# Altium project TS-RTD 1k Wheatstone PGA-ADC.PrjPcb
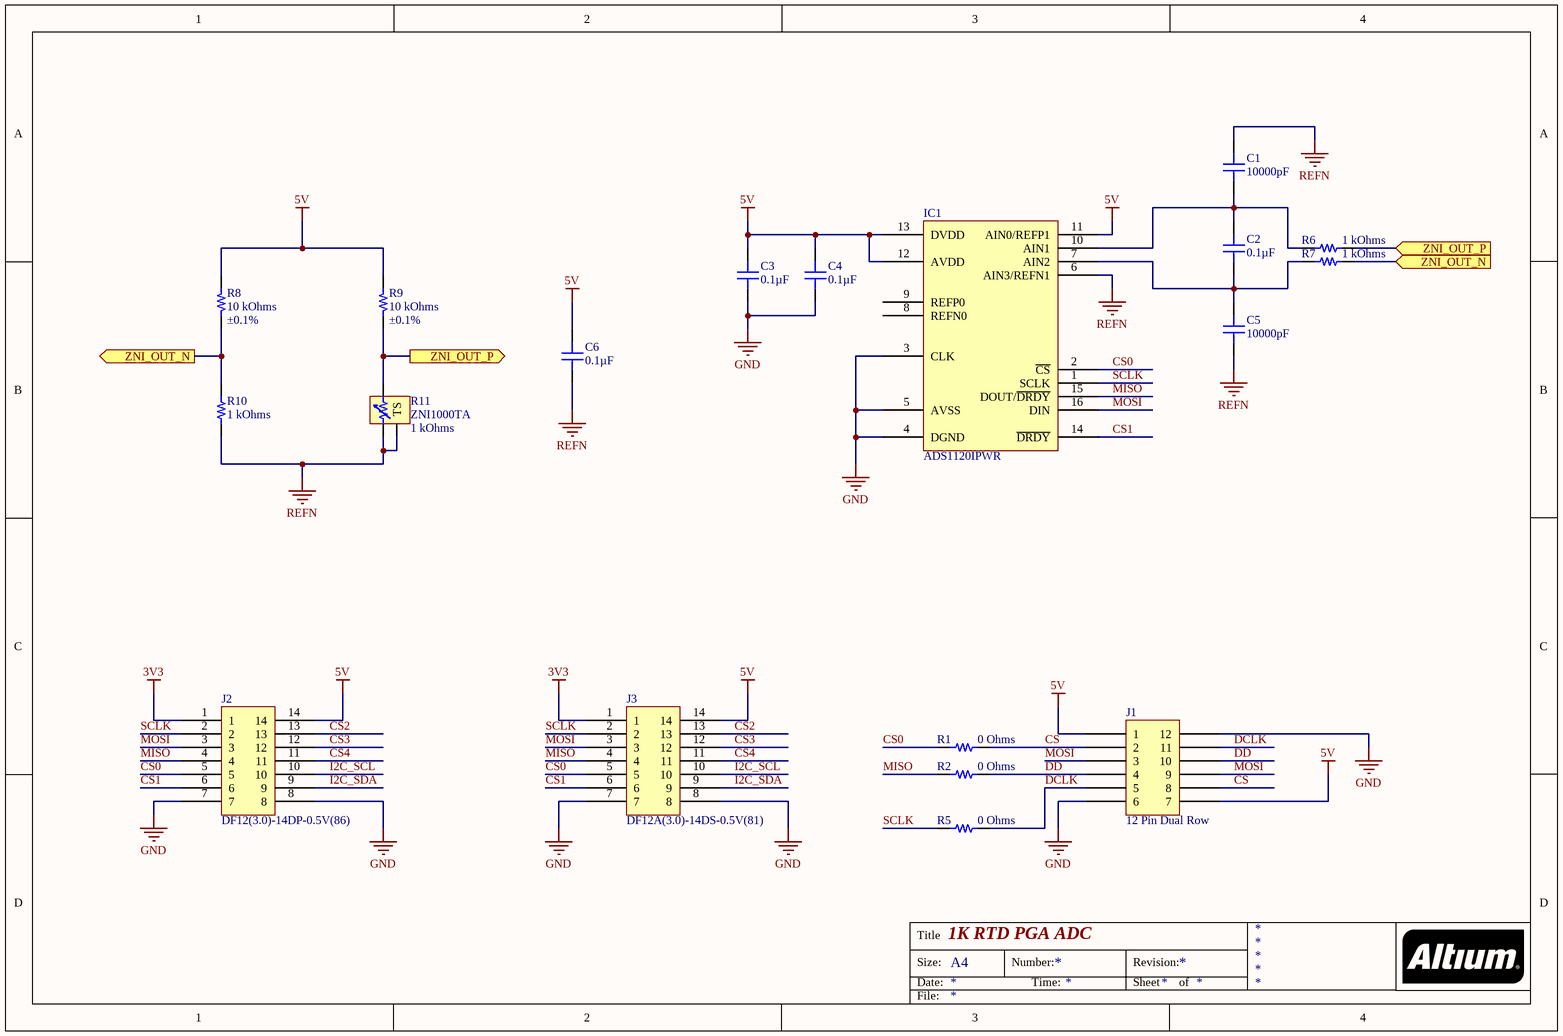
[diagram p0: RTD 1k Wheatstone PGA-ADC.SchDoc]
1 sheet, 19 parts. Net scope: flat (ports and power ports of the same name join across sheets).
Board file: RTD 1k Wheatstone PGA-ADC Card.PcbDoc

## Sheet RTD 1k Wheatstone PGA-ADC.SchDoc: 1K RTD PGA ADC
size A4

### Parts
C1  10000pF  [CAP 0603_1608]
C2  0.1µF  [CAP 0603_1608]
C3  0.1µF  [CAP 0603_1608]
C4  0.1µF  [CAP 0603_1608]
C5  10000pF  [CAP 0603_1608]
C6  0.1µF  [CAP 0603_1608]
IC1  ADS1120IPWR  [TI TSSOP-16 PW]
J1  12 Pin Dual Row  [TE 5650118-3 Card Edge]
J2  DF12(3.0)-14DP-0.5V(86)  [HIROSE DF12 3.0-14DP-0.5V 86]
J3  DF12A(3.0)-14DS-0.5V(81)  [HIROSE DF12A 3.0-14DS-0.5V 81]
R1  0 Ohms  [RES 0603_1608]
R2  0 Ohms  [RES 0603_1608]
R5  0 Ohms  [RES 0603_1608]
R6  1 kOhms  [RES 0603_1608]
R7  1 kOhms  [RES 0603_1608]
R8  Tolerance: ±0.1%  [RES 0603_1608]  (hidden comment: 10 kOhms)
R9  Tolerance: ±0.1%  [RES 0603_1608]  (hidden comment: 10 kOhms)
R10  1 kOhms  [RES 0603_1608]
R11  ZNI1000TA  Resistance @ 0°C: 1 kOhms  [DIODES SOT-23-3]

### Ports
ZNI_OUT_N (in), ZNI_OUT_N (out), ZNI_OUT_P (in), ZNI_OUT_P (out)

### Nets
3V3: J2.1 J3.1
5V: C3.1 C4.1 C6.1 IC1.11(AIN0/REFP1) IC1.12(AVDD) IC1.13(DVDD) J1.1 J1.7 J2.14 J3.14 R8.2 R9.2
GND: C3.2 C4.2 IC1.3(CLK) IC1.4(DGND) IC1.5(AVSS) J1.6 J1.12 J2.7 J2.8 J3.7 J3.8
REFN: C1.2 C5.1 C6.2 IC1.6(AIN3/REFN1) R10.1 R11.1 R11.3(TS)
CS: J1.2 J1.8 R1.2
CS0: IC1.2(~{CS}) J2.5 J3.5 R1.1
CS1: IC1.14(~{DRDY}) J2.6 J3.6
CS2: J2.13 J3.13
CS3: J2.12 J3.12
CS4: J2.11 J3.11
DCLK: J1.5 J1.11 R5.2
DD: J1.4 J1.10 R2.2
I2C_SCL: J2.10 J3.10
I2C_SDA: J2.9 J3.9
MISO: IC1.15(DOUT/~{DRDY}) J2.4 J3.4 R2.1
MOSI: IC1.16(DIN) J1.3 J1.9 J2.3 J3.3
SCLK: IC1.1(SCLK) J2.2 J3.2 R5.1
NetC1_1: C1.1 C2.1 IC1.10(AIN1) R6.2
NetC2_2: C2.2 C5.2 IC1.7(AIN2) R7.2
NetR6_1: R6.1 R9.1 R11.2 ; port ZNI_OUT_P
NetR7_1: R7.1 R8.1 R10.2 ; port ZNI_OUT_N

Not connected (* = marked no-connect by the designer): IC1 8(REFN0) 9(REFP0)

### Notes on the sheet
- Title
- Size:
- Date:
- A4
- Number:
- Time:
- Revision:
- Sheet
- of
- File:

### Library data of the parts
C1 C5 = AC0603KPX7R9BB103: CAP CER 10000PF 50V X7R 0603; Manufacturer: Yageo; Tolerance: ±10%; Part Number: AC0603KPX7R9BB103; Value: 10000pF; Applications: Automotive; Capacitance: 10000pF; ComponentLink1Description: Datasheet; ComponentLink1URL: http://www.yageo.com/NewPortal/_en/search/productDocs.jsp?YageoPartNumber=AC0603KPX7R9BB103; ComponentLink2Description: DigiKey Link; ComponentLink2URL: http://digikey.com/product-detail/en/yageo/AC0603KPX7R9BB103/311-3284-1-ND/6643536; Device Package: 0603 (1608 Metric); LastUpdated: 02/09/2020 01:03:31; Lifecycle Status: Active; Minimum Order: 1; Mounting Type: Surface Mount, MLCC; Operating Temperature: -55°C ~ 125°C; Package / Case: 0603 (1608 Metric); Packaging: TapeAndReel; PartId: 5188; Part Status: Active; Price: 0.01; Ratings: AEC-Q200; Series: AC; Size / Dimension: 0.063" L x 0.031" W (1.60mm x 0.80mm); Supplier 1: DigiKey; Supplier Part Number 1: 311-3284-1-ND; Temperature Coefficient: X7R; Thickness (Max): 0.035" (0.90mm); Voltage - Rated: 50V
C2-C4 C6 = CC0603ZRY5V7BB104: CAP CER 0.1UF 16V Y5V 0603; Manufacturer: Yageo; Temperature Coefficient: Y5V (F); Tolerance: -20%, +80%; Part Number: CC0603ZRY5V7BB104; Value: 0.1µF; Applications: General Purpose; Capacitance: 0.1µF; ComponentLink1Description: Datasheet; ComponentLink1URL: http://www.yageo.com/documents/recent/UPY-GPHC_Y5V_6.3V-to-50V_8.pdf; ComponentLink2Description: DigiKey Link; ComponentLink2URL: http://digikey.com/product-detail/en/yageo/CC0603ZRY5V7BB104/311-1369-1-ND/2103153; Device Package: 0603 (1608 Metric); LastUpdated: 21/01/2020 00:01:38; Lifecycle Status: Active; Minimum Order: 1; Mounting Type: Surface Mount, MLCC; Operating Temperature: -30°C ~ 85°C; Package / Case: 0603 (1608 Metric); Packaging: TapeAndReel; PartId: 17881; Part Status: Active; Price: 0.01; Series: CC; Size / Dimension: 0.063" L x 0.031" W (1.60mm x 0.80mm); Supplier 1: DigiKey; Supplier Part Number 1: 311-1369-1-ND; Thickness (Max): 0.035" (0.90mm); Voltage - Rated: 16V
IC1 = ADS1120IPWR: IC ADC 16BIT SIGMA-DELTA 16TSSOP; Manufacturer: Texas Instruments; Configuration: MUX-PGA-ADC; Data Interface: SPI; Input Type: Differential, Single Ended; Number of A/D Converters: 1; Number of Bits: 16; Number of Inputs: 2, 4; Reference Type: External, Internal, Supply; Sampling Rate (Per Second): 2k; Voltage - Supply, Analog: 2.3V ~ 5.5V; Part Number: ADS1120IPWR; Architecture: Sigma-Delta; ComponentLink1Description: Datasheet; ComponentLink1URL: http://www.ti.com/general/docs/suppproductinfo.tsp?distId=10&gotoUrl=http%3A%2F%2Fwww.ti.com%2Flit%2Fgpn%2Fads1120; ComponentLink2Description: DigiKey Link; ComponentLink2URL: //digikey.com/product-detail/en/texas-instruments/ADS1120IPWR/296-37280-2-ND/4701590; Device Package: 16-TSSOP (0.173", 4.40mm Width); Features: PGA, Temperature Sensor; LastUpdated: 02/12/2019 15:46:46; Lifecycle Status: 0; Minimum Order: 1; Mounting Type: Surface Mount; Operating Temperature: -40°C ~ 125°C; Package / Case: 16-TSSOP (0.173", 4.40mm Width); Packaging: TapeAndReel; PartId: 4; Part Status: Active; Price: 3.47; Series: -; Supplier 1: DigiKey; Supplier Part Number 1: 296-37280-2-ND; Supplier Device Package: 16-TSSOP; Voltage - Supply, Digital: 2.3V ~ 5.5V
J2 = DF12(3.0)-14DP-0.5V(86): CONN HDR 14POS SMD GOLD; Manufacturer: Hirose Electric Co Ltd; Connector Type: Header, Outer Shroud Contacts; Mated Stacking Heights: 3mm; Number of Positions: 14; Pitch: 0.020" (0.50mm); Part Number: DF12(3.0)-14DP-0.5V(86); ComponentLink1Description: Datasheet; ComponentLink1URL: https://www.hirose.com/product/download/?distributor=digikey&type=specSheet&lang=en&num=DF12(3.0)-14DP-0.5V(86); ComponentLink2Description: DigiKey Link; ComponentLink2URL: http://digikey.com/product-detail/en/hirose-electric-co-ltd/DF12-3.0-14DP-0.5V-86/H11701CT-ND/2172493; Contact Finish: Gold; Contact Finish Thickness: 8.00µin (0.203µm); Features: Board Guide, Solder Retention; Height Above Board: 0.091" (2.30mm); LastUpdated: 06/08/2020 22:47:47; Lifecycle Status: Active; Minimum Order: 1; Mounting Type: Surface Mount; Number of Rows: 2; Packaging: TapeAndReel; Part Status: Active; Price: 0.38; Series: DF12; Supplier 1: DigiKey; Supplier Part Number 1: H11701CT-ND
J3 = DF12A(3.0)-14DS-0.5V(81): CONN RCPT 14POS SMD GOLD; Manufacturer: Hirose Electric Co Ltd; Connector Type: Receptacle, Center Strip Contacts; Mated Stacking Heights: 3mm; Number of Positions: 14; Pitch: 0.020" (0.50mm); Part Number: DF12A(3.0)-14DS-0.5V(81); ComponentLink1Description: Datasheet; ComponentLink1URL: https://www.hirose.com/product/document?clcode=CL0537-0721-0-86&productname=DF12(3.0)-10DP-0.5V(86)&series=DF12&documenttype=Catalog&lang=en&documentid=D31693_en; ComponentLink2Description: DigiKey Link; ComponentLink2URL: http://digikey.com/product-detail/en/hirose-electric-co-ltd/DF12A-3.0-14DS-0.5V-81/H11713CT-ND/2172505; Contact Finish: Gold; Contact Finish Thickness: 8.00µin (0.203µm); Features: Board Guide; Height Above Board: 0.087" (2.20mm); LastUpdated: 06/08/2020 22:48:47; Lifecycle Status: Active; Minimum Order: 1; Mounting Type: Surface Mount; Number of Rows: 2; Packaging: TapeAndReel; Part Status: Active; Price: 0.36; Series: DF12; Supplier 1: DigiKey; Supplier Part Number 1: H11713CT-ND
R1 R2 R5 = ERJ-3GEY0R00V: RES SMD 0 OHM JUMPER 1/10W 0603; Manufacturer: Panasonic Electronic Components; Power (Watts): 0.1W, 1/10W; Part Number: ERJ-3GEY0R00V; Value: 0 Ohms; ComponentLink1Description: Datasheet; ComponentLink1URL: http://industrial.panasonic.com/www-cgi/jvcr13pz.cgi?E+PZ+3+AOA0001+ERJ3GEY0R00V+7+WW; ComponentLink2Description: DigiKey Link; ComponentLink2URL: http://digikey.com/product-detail/en/panasonic-electronic-components/ERJ-3GEY0R00V/P0.0GCT-ND/134711; Composition: Thick Film; Device Package: 0603 (1608 Metric); Features: Automotive AEC-Q200; Height - Seated (Max): 0.022" (0.55mm); LastUpdated: 13/08/2020 10:36:40; Lifecycle Status: Active; Minimum Order: 1; Number of Terminations: 2; Operating Temperature: -55°C ~ 155°C; Package / Case: 0603 (1608 Metric); Packaging: CutTape; PartId: 22603; Part Status: Active; Price: 0.10; Ratings: AEC-Q200; Resistance: 0 Ohms; Series: ERJ; Size / Dimension: 0.063" L x 0.031" W (1.60mm x 0.80mm); Supplier 1: DigiKey; Supplier Part Number 1: P0.0GCT-ND; Supplier Device Package: 0603; Tolerance: Jumper
R6 R7 R10 = ERJ-PB3B1001V: RES SMD 1K OHM 0.1% 1/5W 0603; Manufacturer: Panasonic Electronic Components; Power (Watts): 0.2W, 1/5W; Temperature Coefficient: ±50ppm/°C; Part Number: ERJ-PB3B1001V; Value: 1 kOhms; ComponentLink1Description: Datasheet; ComponentLink1URL: https://industrial.panasonic.com/cdbs/www-data/pdf/RDM0000/AOA0000C328.pdf; ComponentLink2Description: DigiKey Link; ComponentLink2URL: http://digikey.com/product-detail/en/panasonic-electronic-components/ERJ-PB3B1001V/P19972CT-ND/6214227; Composition: Thick Film; Device Package: 0603 (1608 Metric); Features: Automotive AEC-Q200, Pulse Withstanding; Height - Seated (Max): 0.022" (0.55mm); LastUpdated: 21/01/2020 00:19:14; Lifecycle Status: Active; Minimum Order: 1; Number of Terminations: 2; Operating Temperature: -55°C ~ 155°C; Package / Case: 0603 (1608 Metric); Packaging: TapeAndReel; PartId: 18865; Part Status: Active; Price: 0.03; Ratings: AEC-Q200; Resistance: 1 kOhms; Series: ERJ; Size / Dimension: 0.063" L x 0.031" W (1.60mm x 0.80mm); Supplier 1: DigiKey; Supplier Part Number 1: P19972CT-ND; Supplier Device Package: 0603; Tolerance: ±0.1%
R8 R9 = ERA-3AEB103V: RES SMD 10K OHM 0.1% 1/10W 0603; Manufacturer: Panasonic Electronic Components; Power (Watts): 0.1W, 1/10W; Temperature Coefficient: ±25ppm/°C; Part Number: ERA-3AEB103V; Value: 10 kOhms; ComponentLink1Description: Datasheet; ComponentLink1URL: https://industrial.panasonic.com/cdbs/www-data/pdf/RDM0000/AOA0000C307.pdf; ComponentLink2Description: DigiKey Link; ComponentLink2URL: http://digikey.com/product-detail/en/panasonic-electronic-components/ERA-3AEB103V/P10KDBCT-ND/1466076; Composition: Thin Film; Device Package: 0603 (1608 Metric); Features: Automotive AEC-Q200; Height - Seated (Max): 0.022" (0.55mm); LastUpdated: 21/01/2020 00:24:44; Lifecycle Status: Active; Minimum Order: 1; Number of Terminations: 2; Operating Temperature: -55°C ~ 155°C; Package / Case: 0603 (1608 Metric); Packaging: TapeAndReel; PartId: 5506; Part Status: Active; Price: 0.04; Ratings: AEC-Q200; Resistance: 10 kOhms; Series: ERA-3A; Size / Dimension: 0.063" L x 0.031" W (1.60mm x 0.80mm); Supplier 1: DigiKey; Supplier Part Number 1: P10KDBCT-ND; Supplier Device Package: 0603
R11 = ZNI1000TA: SENSOR RTD 1KOHM 5% TO236-3; Manufacturer: Diodes Incorporated; Accuracy: ±0.4°C; Current: 3mA; RTD Material: Nickel; Part Number: ZNI1000TA; ComponentLink1Description: Datasheet; ComponentLink1URL: https://www.diodes.com/assets/Datasheets/ZNI1000.pdf; ComponentLink2Description: DigiKey Link; ComponentLink2URL: http://digikey.com/product-detail/en/diodes-incorporated/ZNI1000TA/ZNI1000CT-ND/1211584; Device Package: TO-236-3, SC-59, SOT-23-3; LastUpdated: 25/05/2020 21:35:29; Lifecycle Status: Active; Minimum Order: 1; Mounting Type: Surface Mount; Operating Temperature: -55°C ~ 150°C; Package / Case: TO-236-3, SC-59, SOT-23-3; Packaging: TapeAndReel; Part Status: Active; Price: 1.16; Supplier 1: DigiKey; Supplier Part Number 1: ZNI1000CT-ND; Termination: SMD (SMT) Tabs